# EAGLE design Adafruit DRV2605L STEMMA QT (EAGLE 9.6.2)
COMPANY: ADAFRUIT INDUSTRIES; DRAWN: KTOWN; REV: A
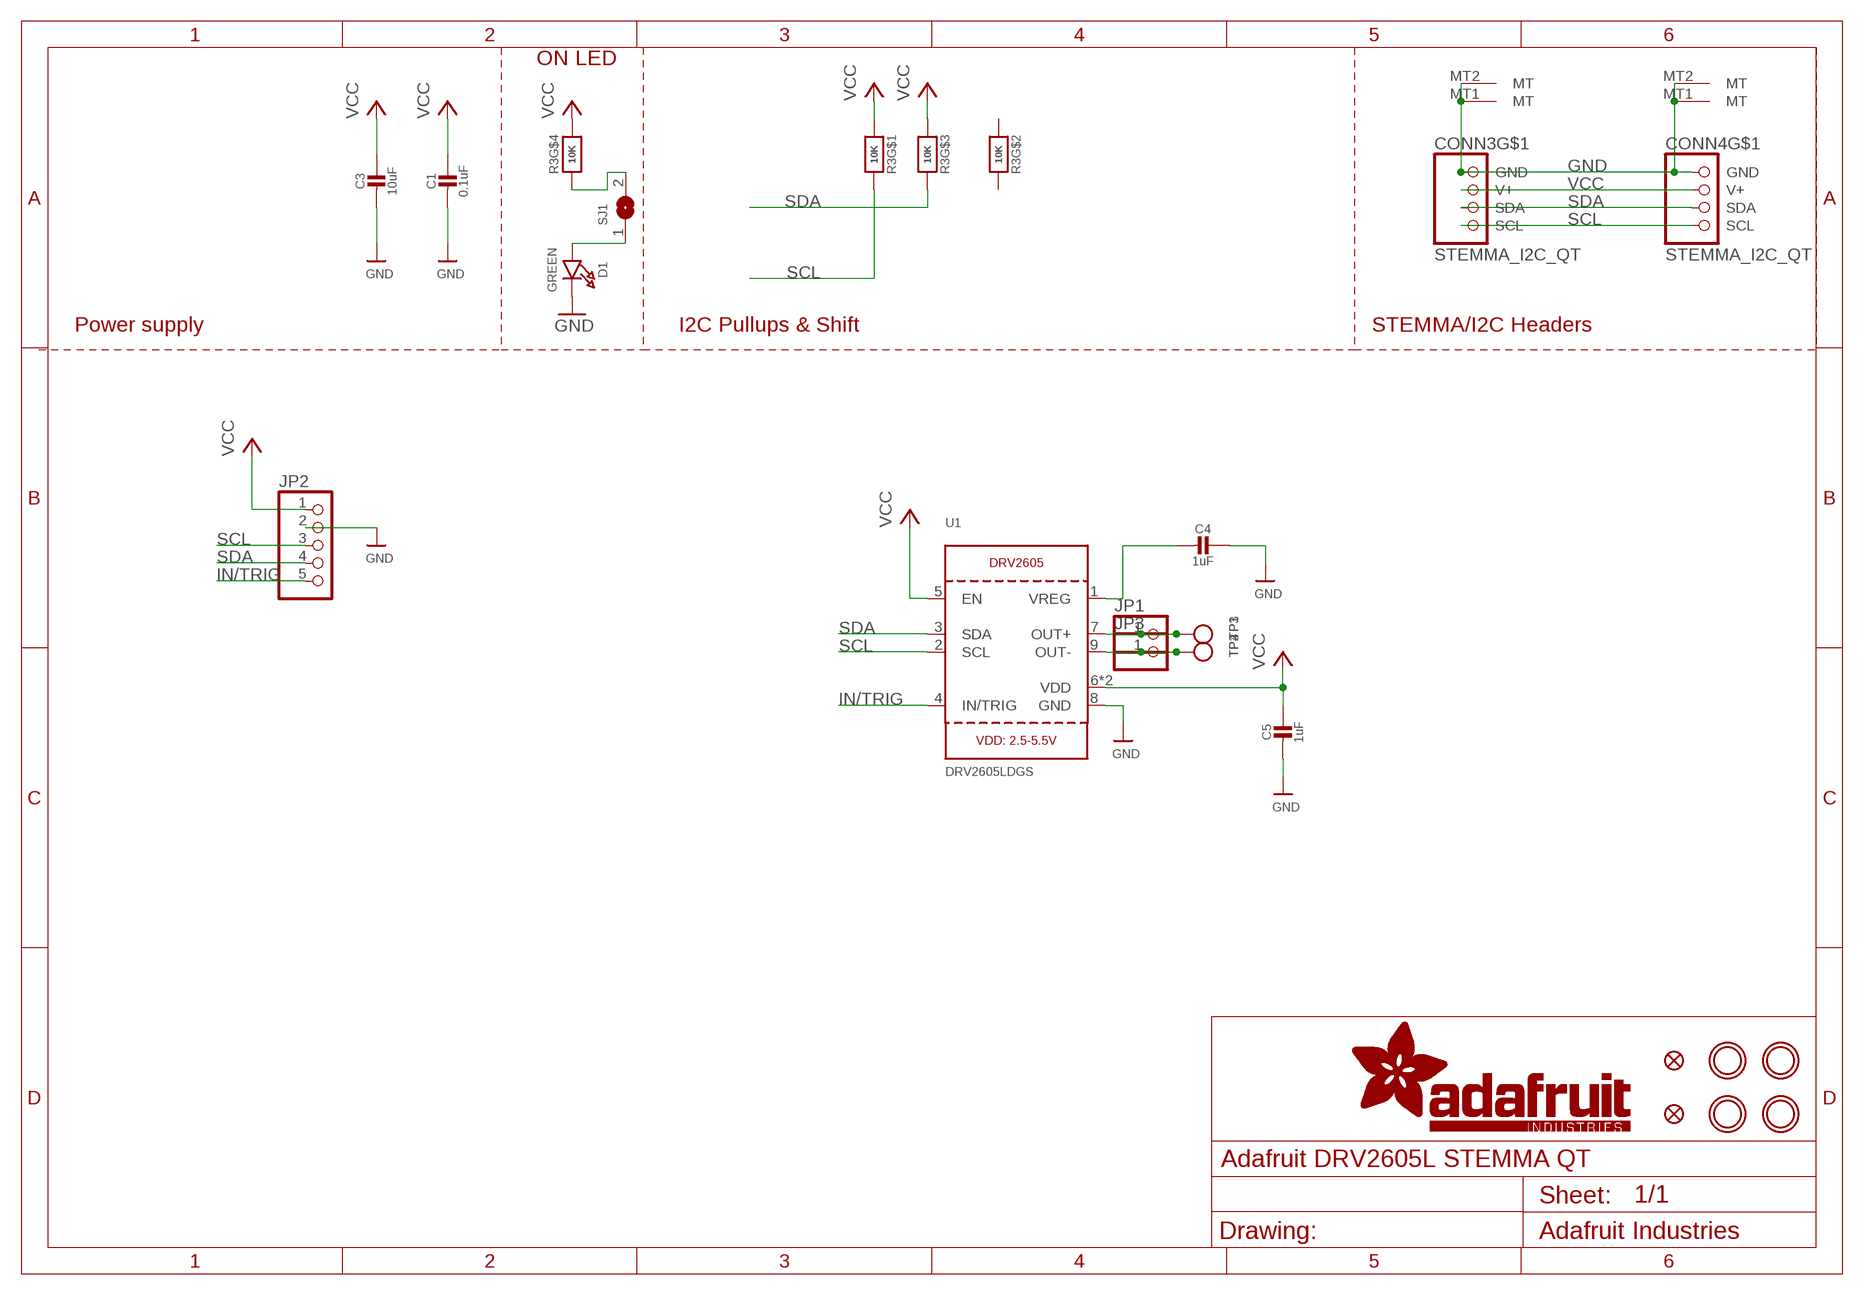
[diagram p0: schematic, sheet 1]

## Parts
C1  0.1uF  CAP_CERAMIC0603_NO  [0603-NO]
C3  10uF  CAP_CERAMIC0805-NOOUTLINE  [0805-NO]
C4  1uF  CAP_CERAMIC0603_NO  [0603-NO]
C5  1uF  CAP_CERAMIC0603_NO  [0603-NO]
CONN3  STEMMA_I2C_QT  [JST_SH4]
CONN4  STEMMA_I2C_QT  [JST_SH4]
D1  GREEN  LED0603_NOOUTLINE  [CHIPLED_0603_NOOUTLINE]
FID3  FIDUCIAL_1MM  [FIDUCIAL_1MM]
FID4  FIDUCIAL_1MM  [FIDUCIAL_1MM]
JP1  HEADER-1X1  [1X01_OVAL]
JP2  HEADER-1X576MIL  [1X05_ROUND_76]
JP3  HEADER-1X1  [1X01_OVAL]
R3  10K  RESISTOR_4PACK  [RESPACK_4X0603]
SJ1  SOLDERJUMPERCLOSED  [SOLDERJUMPER_CLOSEDWIRE]
TP1  TESTPOINTPAD2MM  [TESTPOINT_PAD_2MM]
TP2  TESTPOINTPAD2MM  [TESTPOINT_PAD_2MM]
TP3  TESTPOINTPAD2MM  [TESTPOINT_PAD_2MM]
TP4  TESTPOINTPAD2MM  [TESTPOINT_PAD_2MM]
U1  DRV2605LDGS  DRV2605_SOP  [PSOP10]
U$1  MOUNTINGHOLE2.5  [MOUNTINGHOLE_2.5_PLATED]
U$17  MOUNTINGHOLE2.5  [MOUNTINGHOLE_2.5_PLATED]
U$19  MOUNTINGHOLE2.5  [MOUNTINGHOLE_2.5_PLATED]
U$21  MOUNTINGHOLE2.5  [MOUNTINGHOLE_2.5_PLATED]

## Nets
GND [highpower]: C1.2 C3.2 C4.1 C5.2 CONN3.1(GND) CONN3.MT1(MT) CONN3.MT2(MT) CONN4.1(GND) CONN4.MT1(MT) CONN4.MT2(MT) D1.C JP2.2 U1.8(GND)
IN/TRIG: JP2.5 U1.4(IN/TRIG)
N$1: R3.4 SJ1.2
N$2: D1.A SJ1.1
N$5: C4.2 U1.1(VREG)
OUT+: JP1.1 TP1.P$1 TP3.P$1 U1.7(OUT+)
OUT-: JP3.1 TP2.P$1 TP4.P$1 U1.9(OUT-)
SCL: CONN3.4(SCL) CONN4.4(SCL) JP2.3 R3.8 U1.2(SCL)
SDA: CONN3.3(SDA) CONN4.3(SDA) JP2.4 R3.6 U1.3(SDA)
VCC [highpower]: C1.1 C3.1 C5.1 CONN3.2(V+) CONN4.2(V+) JP2.1 R3.1 R3.3 R3.5 U1.5(EN) U1.6(VDD) U1.10(VDD)
Unconnected: R3.2 R3.7

## Notes on the sheet
- ON LED
- Power supply | I2C Pullups & Shift | STEMMA/I2C Headers

## Library data of the parts
C1 C3-C5 = microbuilder:CAP_CERAMIC: Ceramic Capacitors For new designs, use the packages preceded by an '_' character since they are more reliable: The following footprints should be used on most boards: _0402 - Standard footprint for regular board layouts _0603 - Standard footprint for regular board layouts _0805 - Standard footprint for regular board layouts _1206 - Standard footprint for regular board layouts For extremely tight-pitch boards where space is at a premium, the following 'micro-pitch' footprints can be used (smaller pads, no silkscreen outline, etc.): _0402MP - Micro-pitch footprint for very dense/compact boards _0603MP - Micro-pitch footprint for very dense/compact boards _0805MP - Micro-pitch footprint for very dense/compact boards _1206MP - Micro-pitch footprint for very dense/compact boards
CONN3 CONN4 = microbuilder:STEMMA_I2C
D1 = microbuilder:LED: LED 0603 - 0603 Surface Mount Package 2mA: Green LED - Low Power (3.9mcd, 2ma, 1.7Vf) - Digikey: 475-2709-2-ND Orange LED - Low Power (9.8mcd, 2ma, 1.8Vf) - Digikey: 475-1194-2-ND Red LED - Low Power (5mcd, 2ma, 1.8Vf) - Digikey: 475-1195-2-ND Yellow LED - Low Power (7mcd, 2ma, 1.8Vf) - Digikey: 475-1196-2-ND 5mA: Blue LED - Low Power (17mcd, 5ma, 2.9Vf) - Digikey: LNJ937W8CRACT-ND 0805 - 0805 Surface Mount Package 2mA: Red LED (8.8mcd, 2mA, 1.8Vf, Clear) - Low Power [Digikey: 475-2510-1-ND] Green LED (5mcd, 2mA, 1.8Vf, Clear) - Low Power [Digikey: 475-2730-1-ND] Yellow LED (11.3mcd, 2mA, 1.8Vf, Clear) - Low Power [Digikey: 475-2555-1-ND] 20mA: Red LED (104mcd, 20mA, Diffused) - LS R976 [Digikey: 475-1278-6-ND] Red LED (12mcd, 20mA, 2.0Vf, Clear) - APT2012EC [Digikey: 754-1128-1-ND] Green LED (15mcd, 20mA, 2.2Vf, Clear) - APT2012GC [Digikey: 754-1131-1-ND] Orange LED (160mcd, 20mA, 2.1Vf, Clear) - APT2012SECK [Digikey: 754-1130-1-ND] 1206 - 1206 Surface Mount Package Green LED (26mcd, 20mA, Diffused) - LG N971 [Digikey: 475-1407-6-ND] Red LED (15mcd, 20mA, Diffused) - LH N974 [Digikey: 475-1416-6-ND] Cree - Cree High-Power Surface Mount LEDs XPEBWT-L1-0000-00D50 - White 111lm 350mA 2.9Vf 6200K 110° XTEAWT-00-0000-00000LEE3 - White 114lm 350mA 2.85Vf 5000K 115° Everlight - Everlight 45-21 Series Surface Mount LEDs 45-21/QK2C-B2832AC2CB2/2T - Warm White 2000mcd 20mA 3.25Vf 3050K 120° 45-21/LK2C-B38452C4CB2/2T - Nuetral White 2000mcd 20mA 3.25Vf 4150K 120° 45-21/LK2C-B50634C6CB2/2T - Cold White 2200mcd 20mA 3.25Vf 5650K 120° PLCC2 Reverse Mount LS T77K-J1L2-1-0-2-R18-Z - Red 11.25mcd 2mA 1.8Vf 630nm 120° LO T77K-L1M2-24-Z - Orange 19.6mcd 2mA 1.8Vf 606nm 120° LY T77K-K2M1-26-Z - Yellow 15.7mcd 2mA 1.8Vf 587nm 120°
FID3 FID4 = microbuilder:FIDUCIAL: Fiducial Alignment Points Various fiducial points for machine vision alignment.; BOM: EXCLUDE
JP1 JP3 = microbuilder:HEADER-1X1: PIN HEADER
JP2 = microbuilder:HEADER-1X5: PIN HEADER
R3 = microbuilder:RESISTOR_4PACK: Resistor Packs (4 resistors) 4 x 0603 10K 1/16W - Digikey: YC164J-10KCT-ND
SJ1 = microbuilder:SOLDERJUMPER: SMD Solder JUMPER Solder the two pads together to create a connection, or remove the solder to break it. REFLOW - Use this footprint for solder paste and reflow ovens. WAVE - Use this footprint for hand-soldering (larger pads). CLOSED - Has a trace between the two pads to ensure it is closed by default. The trace needs to be cut to disable the jumper, and can be closed again by creating a solder bridge between the two pads.
TP1-TP4 = microbuilder:TESTPOINT: Test Point Various test points for characterisation and PCB testing TESTPOINT_SMT - Compact Surface Mount Test Point [Digikey: 5016KTR-ND]
U1 = microbuilder:DRV2605: DRV2605 - Haptic Driver for ERM/LRA Motors
U$1 U$17 U$19 U$21 = adafruit_electromech:MOUNTINGHOLE: Mounting Hole For #2 screws (0.086"/2.18mm width, 0.094"/2.4mm hole) use 2.5mm; BOM: EXCLUDE

## Net classes
1 highpower: width 0.305 mm, drill 0.483 mm
2 lowpower: width 0.254 mm, drill 0.483 mm

## Board
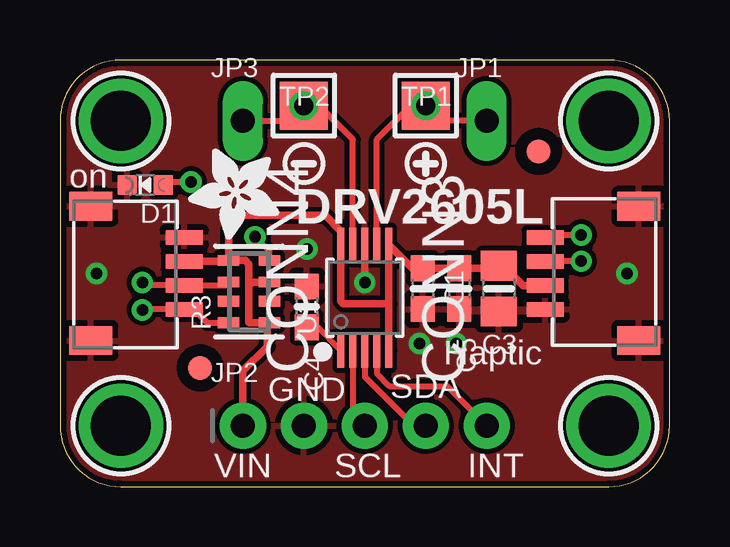
[diagram p1: board, top side]
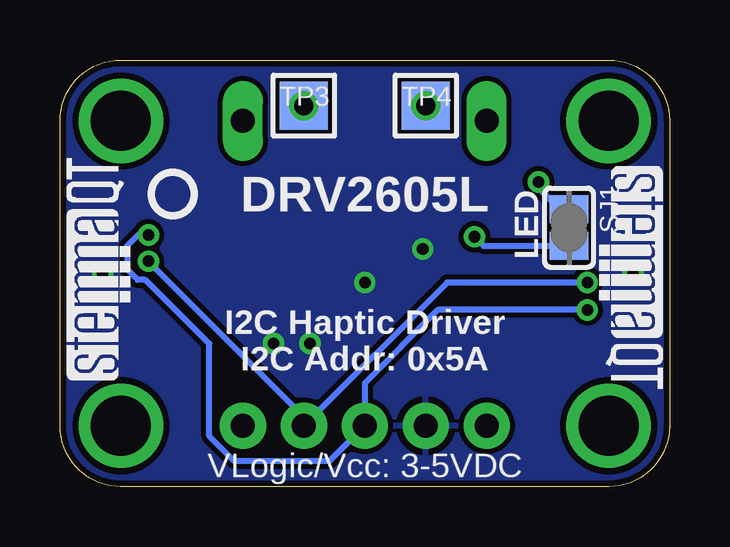
[diagram p2: board, bottom side, seen from below]

Size 25.4 x 17.78 mm. Coordinates in mm from the lower left corner, seen from the top.
Outline: 0,15.24 0,2.54 arc90 2.54,0 22.86,0 arc90 25.4,2.54 25.4,15.24 arc90 22.86,17.78 2.54,17.78 arc90 0,15.24
Copper layers (1*16): Top 0.035mm / dielectric 1.5mm / Bottom 0.035mm
Design rules "adafruit *": minimum track width 8mil, minimum drill 15.5mil, track to track 8mil, track to pad 8mil, pad to pad 8mil, via to via 8mil, smd to smd 8mil, copper to edge 10mil, drill to drill 8mil, minimum pad ring 10mil, minimum via ring 8mil, stop-mask expansion 2mil, vias tented up to drill 20mil, thermal gap 10mil

### Footprints (pad centres in the part's own frame; a part is rotated, then mirrored left to right if it is on the bottom)
0603-NO = smd 1.075 x 1: 1 -0.85,0; 2 0.85,0
0805-NO = smd 1.24 x 1.5: 1 -0.95,0; 2 0.95,0
JST_SH4 = smd 0.6 x 1.55: 1 -1.5,2.514; 2 -0.5,2.514; 3 0.5,2.514; 4 1.5,2.514 | smd 1.2 x 1.8: MT1 -2.8,-1.386; MT2 2.8,-1.386
CHIPLED_0603_NOOUTLINE = smd 0.8 x 0.8: A 0,-0.75; C 0,0.75
FIDUCIAL_1MM = smd 1 x 1: 1 0,0
1X01_OVAL = drill 1 pad 1.676 long: 1 0,0
1X05_ROUND_76 = drill 1 pad 1.93: 1 -5.08,0; 2 -2.54,0; 3 0,0; 4 2.54,0; 5 5.08,0
RESPACK_4X0603 = smd 0.45 x 0.9: 1 -1.3,-0.85; 2 -0.4,-0.85; 3 0.4,-0.85; 4 1.3,-0.85; 5 1.3,0.85; 6 0.4,0.85; 7 -0.4,0.85; 8 -1.3,0.85
SOLDERJUMPER_CLOSEDWIRE = smd 1.168 x 1.6: 1 -0.762,0; 2 0.762,0 | smd 0.635 x 0.203: WIRE 0,0
TESTPOINT_PAD_2MM = smd 2 x 2: P$1 0,0
PSOP10 = smd 0.28 x 1.45: 1 -1,-2.2; 2 -0.5,-2.2; 3 0,-2.2; 4 0.5,-2.2; 5 1,-2.2; 6 1,2.2; 7 0.5,2.2; 8 0,2.2; 9 -0.5,2.2; 10 -1,2.2
MOUNTINGHOLE_2.5_PLATED = drill 2.5 pad 3.2: P$1 0,0

### Placement (x,y rotation side)
C1  15.11,8.26 270 top
C3  18.29,8.26 270 top
C4  10.29,7.49 270 top
C5  16.64,8.26 270 top
CONN3  22.73,8.89 90 top
CONN4  2.67,8.89 270 top
D1  3.56,12.57 90 top
FID3  5.84,4.95 0 top
FID4  19.94,13.97 0 top
JP1  17.78,15.24 0 top
JP2  12.7,2.54 0 top
JP3  7.62,15.24 0 top
R3  7.87,8.13 90 top
SJ1  4.19,10.79 270 bottom
TP1  15.24,15.88 0 top
TP2  10.16,15.88 0 top
TP3  15.24,15.88 0 bottom
TP4  10.16,15.88 0 bottom
U1  12.7,7.87 0 top
U$1  2.54,15.24 0 top
U$2  [SYMBOL_PLUS]  15.24,13.46 0 top
U$3  [SYMBOL_MINUS]  10.16,13.46 0 top
U$17  22.86,15.24 0 top
U$19  2.54,2.54 0 top
U$21  22.86,2.54 0 top
U$22  [ADAFRUIT_3.5MM]  9.14,14.1 180 top
U$25  [PCBFEAT-REV-040]  20.7,12.19 0 bottom
U$30  [STEMMAQT]  22.48,4.45 90 bottom
U$31  [STEMMAQT]  2.92,13.34 270 bottom

### Tracks (layer width: path | path; a pad name or v marks a point on that pad's centre or on a via)
GND  (via drill 0.48)
  Top 0.305: U1.8 v12.7,8.51
  other vias: 10.29,9.91 14.99,5.97 16.51,5.97 1.52,8.89 23.62,8.89
  pour Top: 0,17.78 25.4,17.78 25.4,0 0,0
  pour Bottom: 0,17.78 25.4,17.78 25.4,0 0,0
IN/TRIG
  Top 0.254: U1.4 13.2,4.72 13.73,4.19 16.13,4.19 JP2.5
N$1  (via drill 0.48)
  Top 0.254: R3.4 8.72,9.82 v8.13,10.41
  Bottom 0.254: v8.13,10.41 7.75,10.03 SJ1.2
N$2  (via drill 0.48)
  Top 0.254: D1.A 4.43,12.7 v5.46,12.7
  Bottom 0.254: SJ1.1 4.57,11.56 5.46,12.45 v5.46,12.7
N$5
  Top 0.254: U1.1 10.73,6.64 C4.2
OUT+  (via drill 0.8)
  Top 0.254: U1.7 13.2,14.47 14.61,15.88 TP3.P$1 15.88,15.24 JP1.1
  other vias: 15.24,15.88
OUT-  (via drill 0.8)
  Top 0.254: U1.9 12.2,14.47 10.79,15.88 TP4.P$1 9.53,15.24 JP3.1
  other vias: 10.16,15.88
SCL  (via drill 0.48)
  Top 0.254: R3.8 6.13,6.83 5.56,7.39 CONN4.4 3.45,7.39 v3.43,7.37 | U1.2 12.2,3.04 JP2.3 | CONN3.4 20.32,10.49 v21.72,10.49
  Bottom 0.254: v3.43,7.37 9.65,7.37 12.7,4.32 JP2.3 14.17,1.07 18.14,1.07 19.18,2.1 19.18,5.96 21.84,8.62 22.16,8.62 22.61,9.06 22.61,10.03 22.15,10.49 v21.72,10.49
SDA  (via drill 0.48)
  Top 0.254: R3.6 6.89,8.39 CONN4.3 3.55,8.39 v3.43,8.51 | U1.3 12.7,4.57 14.73,2.54 JP2.4 | v21.72,9.4 21.71,9.39 CONN3.3
  Bottom 0.254: v3.43,8.51 9.27,8.51 JP2.4 15.24,2.92 v21.72,9.4
VCC
  Top 0.305: R3.1 8.64,6.83 | 8.64,6.83 7.9,6.83 7.87,6.86 7.87,8.38 | 7.87,8.38 8.02,8.53 R3.3 | R3.5 7.72,9.43 7.87,9.27 7.87,8.38 | CONN4.2 6.99,9.39 R3.5 | JP2.1 7.62,4.83 8.64,5.84 8.64,6.83 | 13.86,9.92 14.67,9.11 C1.1 C5.1 18.19,9.11 C3.1 18.48,9.21 19.3,8.38 CONN3.2 | 13.86,9.92 U1.6 | U1.5 13.7,7.62 | 13.7,7.62 13.7,9.76 13.86,9.92 | 13.7,7.62 11.81,7.62 11.7,7.73 U1.10 11.7,10.65 11.05,11.3 7.62,11.3 7.02,10.71 R3.5

### Text on the board
tPlace: on | DRV2605L | Haptic | GND | SDA | VIN | SCL | INT
bPlace: DRV2605L | LED | I2C Haptic Driver / I2C Addr: 0x5A | VLogic/Vcc: 3-5VDC